# Altium schematic sheet Converter_Voltage to Current_2.SchDoc
size 190 x 106 mm
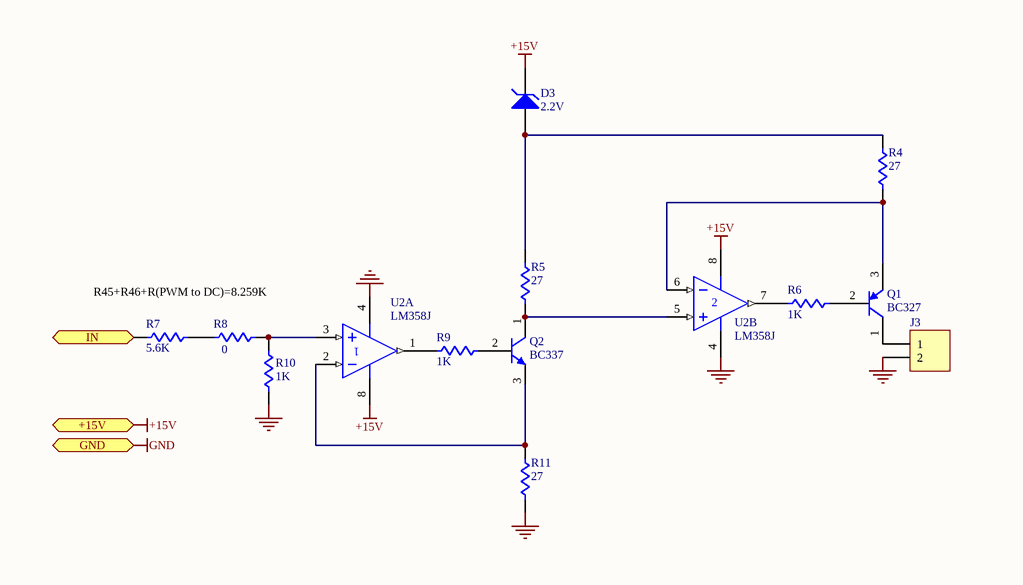
[diagram p0: Converter_Voltage to Current_2.SchDoc]

## Parts
D3  value 2.2V  [DIODE-0.4]  (hidden comment: D Zener)
J3  Header 2  [Fonics_2PIN_1]  (value not drawn)
Q1  Device: BC327  [TO92C]  (hidden comment: PNP)
Q2  value BC337  [TO92C]  (hidden comment: NPN)
R4  value 27  [AXIAL-0.4]  (hidden comment: Res1)
R5  value 27  [AXIAL-0.4]  (hidden comment: Res1)
R6  value 1K  [AXIAL-0.4]  (hidden comment: Res1)
R7  value 5.6K  [AXIAL-0.4]  (hidden comment: Res1)
R8  value 0  [AXIAL-0.4]  (hidden comment: Res1)
R9  value 1K  [AXIAL-0.4]  (hidden comment: Res1)
R10  value 1K  [AXIAL-0.4]  (hidden comment: Res1)
R11  value 27  [AXIAL-0.4]  (hidden comment: Res1)
U2  LM358J  [693-02]  (parts A,B of 2)

## Ports
+15V (in), GND (in), IN (in)

## Nets
+15V: D3.2(K) U2.8(V+) ; port +15V
GND: J3.2 R10.2 R11.1 U2.4(V-) ; port GND
IN: R7.1 ; port IN
NetD3_1: D3.1(A) R4.2 R5.2
NetJ3_1: J3.1 Q1.1(C)
NetQ1_2: Q1.2(B) R6.2
NetQ1_3: Q1.3(E) R4.1 U2.6(IN-)
NetQ2_1: Q2.1(C) R5.1 U2.5(IN+)
NetQ2_2: Q2.2(B) R9.2
NetQ2_3: Q2.3(E) R11.2 U2.2(IN-)
NetR6_1: R6.1 U2.7(OUT)
NetR7_2: R7.2 R8.1
NetR8_2: R8.2 R10.1 U2.3(IN+)
NetR9_1: R9.1 U2.1(OUT)

## Notes on the sheet
- R45+R46+R(PWM to DC)=8.259K

## Library data of the parts
D3 = D Zener: Zener Diode; Manufacturer: Generic Components; Class I: Discrete; Class II: Diode - Zener; Published: 8-Jun-2000; Revision: July-2002: Re-released for DXP Platform.; Publisher: Altium Limited
J3 = Header 2: Header, 2-Pin; LatestRevisionDate: 17-Jul-2002; LatestRevisionNote: Re-released for DXP Platform.; Publisher: Altium Limited
Q1 = PNP: Silicon Bipolar Transistor; Package Reference: TO-92A
Q2 = NPN: NPN Bipolar Transistor; Manufacturer: Generic Components; Class I: Discrete; Class II: BJT - Low Power; Published: 8-Jun-2000; Revision: July-2002: Re-released for DXP Platform.; Publisher: Altium Limited
R4-R11 = Res1: Resistor; Manufacturer: Generic Components; Class I: Passive; Published: 8-Jun-2000; Revision: July-2002: Re-released for DXP Platform.; Publisher: Altium Limited; Class II: Resistor
U2 = LM358J: Dual Low-Power Operational Amplifier; Published: 17-Jul-2002; LatestRevisionDate: 06-Jun-2005; LatestRevisionNote: Stylized 3D Model Added.; DatasheetVersion: 1988; PackageReference: 693-02; Publisher: Altium Limited; PackageDescription: DIP; 8 Leads; Row Spacing 7.62 mm; Pitch 2.54 mm; Code_JEDEC: MO-001-AN; ComponentLink1Description: Manufacturer Link; ComponentLink1URL: http://www.onsemi.com/site/products/parametrics/0,4446,251,00.html; ComponentLink2Description: Datasheet; ComponentLink2URL: http://www.onsemi.com/pub/Collateral/LM358-D.PDF